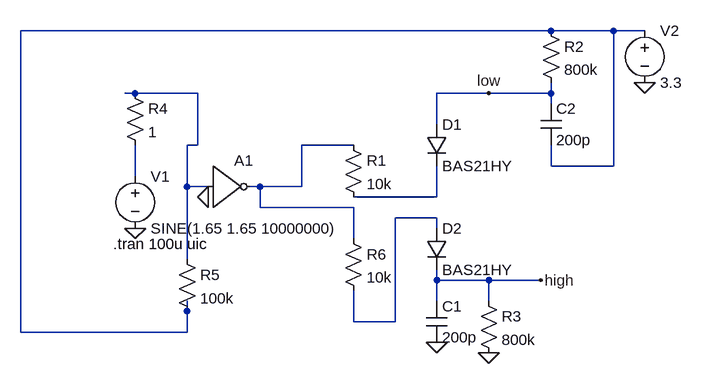
[diagram p0: schematic osc_detect.asc]
osc_detect.asc, the LTspice schematic file:
Version 4
SHEET 1 880 680
WIRE 608 -80 -208 -80
WIRE 704 -80 608 -80
WIRE 752 -80 704 -80
WIRE -32 16 -48 16
WIRE 64 16 -32 16
WIRE 512 16 432 16
WIRE 608 16 608 0
WIRE 608 16 512 16
WIRE 608 32 608 16
WIRE 432 64 432 16
WIRE 64 96 64 16
WIRE 64 96 48 96
WIRE 304 96 224 96
WIRE 608 128 608 96
WIRE 704 128 704 -80
WIRE 704 128 608 128
WIRE -32 144 -32 96
WIRE 48 160 48 96
WIRE 80 160 48 160
WIRE 160 160 144 160
WIRE 224 160 224 96
WIRE 224 160 160 160
WIRE 432 176 432 128
WIRE 432 176 304 176
WIRE 160 192 160 160
WIRE 304 192 160 192
WIRE 432 208 368 208
WIRE 432 224 432 208
WIRE 304 240 304 192
WIRE 48 272 48 160
WIRE 432 304 432 288
WIRE 512 304 432 304
WIRE 592 304 512 304
WIRE 432 336 432 304
WIRE 512 336 512 304
WIRE 48 352 48 336
WIRE 304 368 304 320
WIRE 368 368 368 208
WIRE 368 368 304 368
WIRE -208 384 -208 -80
WIRE 48 384 48 352
WIRE 48 384 -208 384
FLAG -32 224 0
FLAG 80 176 0
FLAG 432 400 0
FLAG 512 416 0
FLAG 752 0 0
FLAG 512 16 low
FLAG 592 304 high
SYMBOL voltage -32 128 R0
WINDOW 123 0 0 Left 0
WINDOW 39 0 0 Left 0
SYMATTR InstName V1
SYMATTR Value SINE(1.65 1.65 10000000)
SYMBOL res 288 80 R0
SYMATTR InstName R1
SYMATTR Value 10k
SYMBOL Digital\\inv 80 96 R0
SYMATTR InstName A1
SYMATTR SpiceLine Vhigh=3.3
SYMBOL diode 416 64 R0
SYMATTR InstName D1
SYMATTR Value BAS21HY
SYMBOL diode 416 224 R0
SYMATTR InstName D2
SYMATTR Value BAS21HY
SYMBOL cap 416 336 R0
SYMATTR InstName C1
SYMATTR Value 200p
SYMBOL cap 592 32 R0
SYMATTR InstName C2
SYMATTR Value 200p
SYMBOL res 592 -96 R0
SYMATTR InstName R2
SYMATTR Value 800k
SYMBOL res 496 320 R0
SYMATTR InstName R3
SYMATTR Value 800k
SYMBOL voltage 752 -96 R0
WINDOW 123 0 0 Left 0
WINDOW 39 0 0 Left 0
SYMATTR InstName V2
SYMATTR Value 3.3
SYMBOL res -48 0 R0
SYMATTR InstName R4
SYMATTR Value 1
SYMBOL res 32 256 R0
SYMATTR InstName R5
SYMATTR Value 100k
SYMBOL res 288 224 R0
SYMATTR InstName R6
SYMATTR Value 10k
TEXT -66 248 Left 2 !.tran 100u uic

The netlist it stands for:
* osc_detect.asc
V1 N004 0 SINE(1.65 1.65 10000000)
R1 N003 N005 10k
A1 N002 0 0 0 0 N003 0 0 BUF Vhigh=3.3
D1 low N005 BAS21HY
D2 N006 high BAS21HY
C1 high 0 200p
C2 low N001 200p
R2 N001 low 800k
R3 high 0 800k
V2 N001 0 3.3
R4 N002 N004 1
R5 N002 N001 100k
R6 N003 N006 10k
.model D D
.lib standard.dio
.tran 100u uic
.backanno
.end